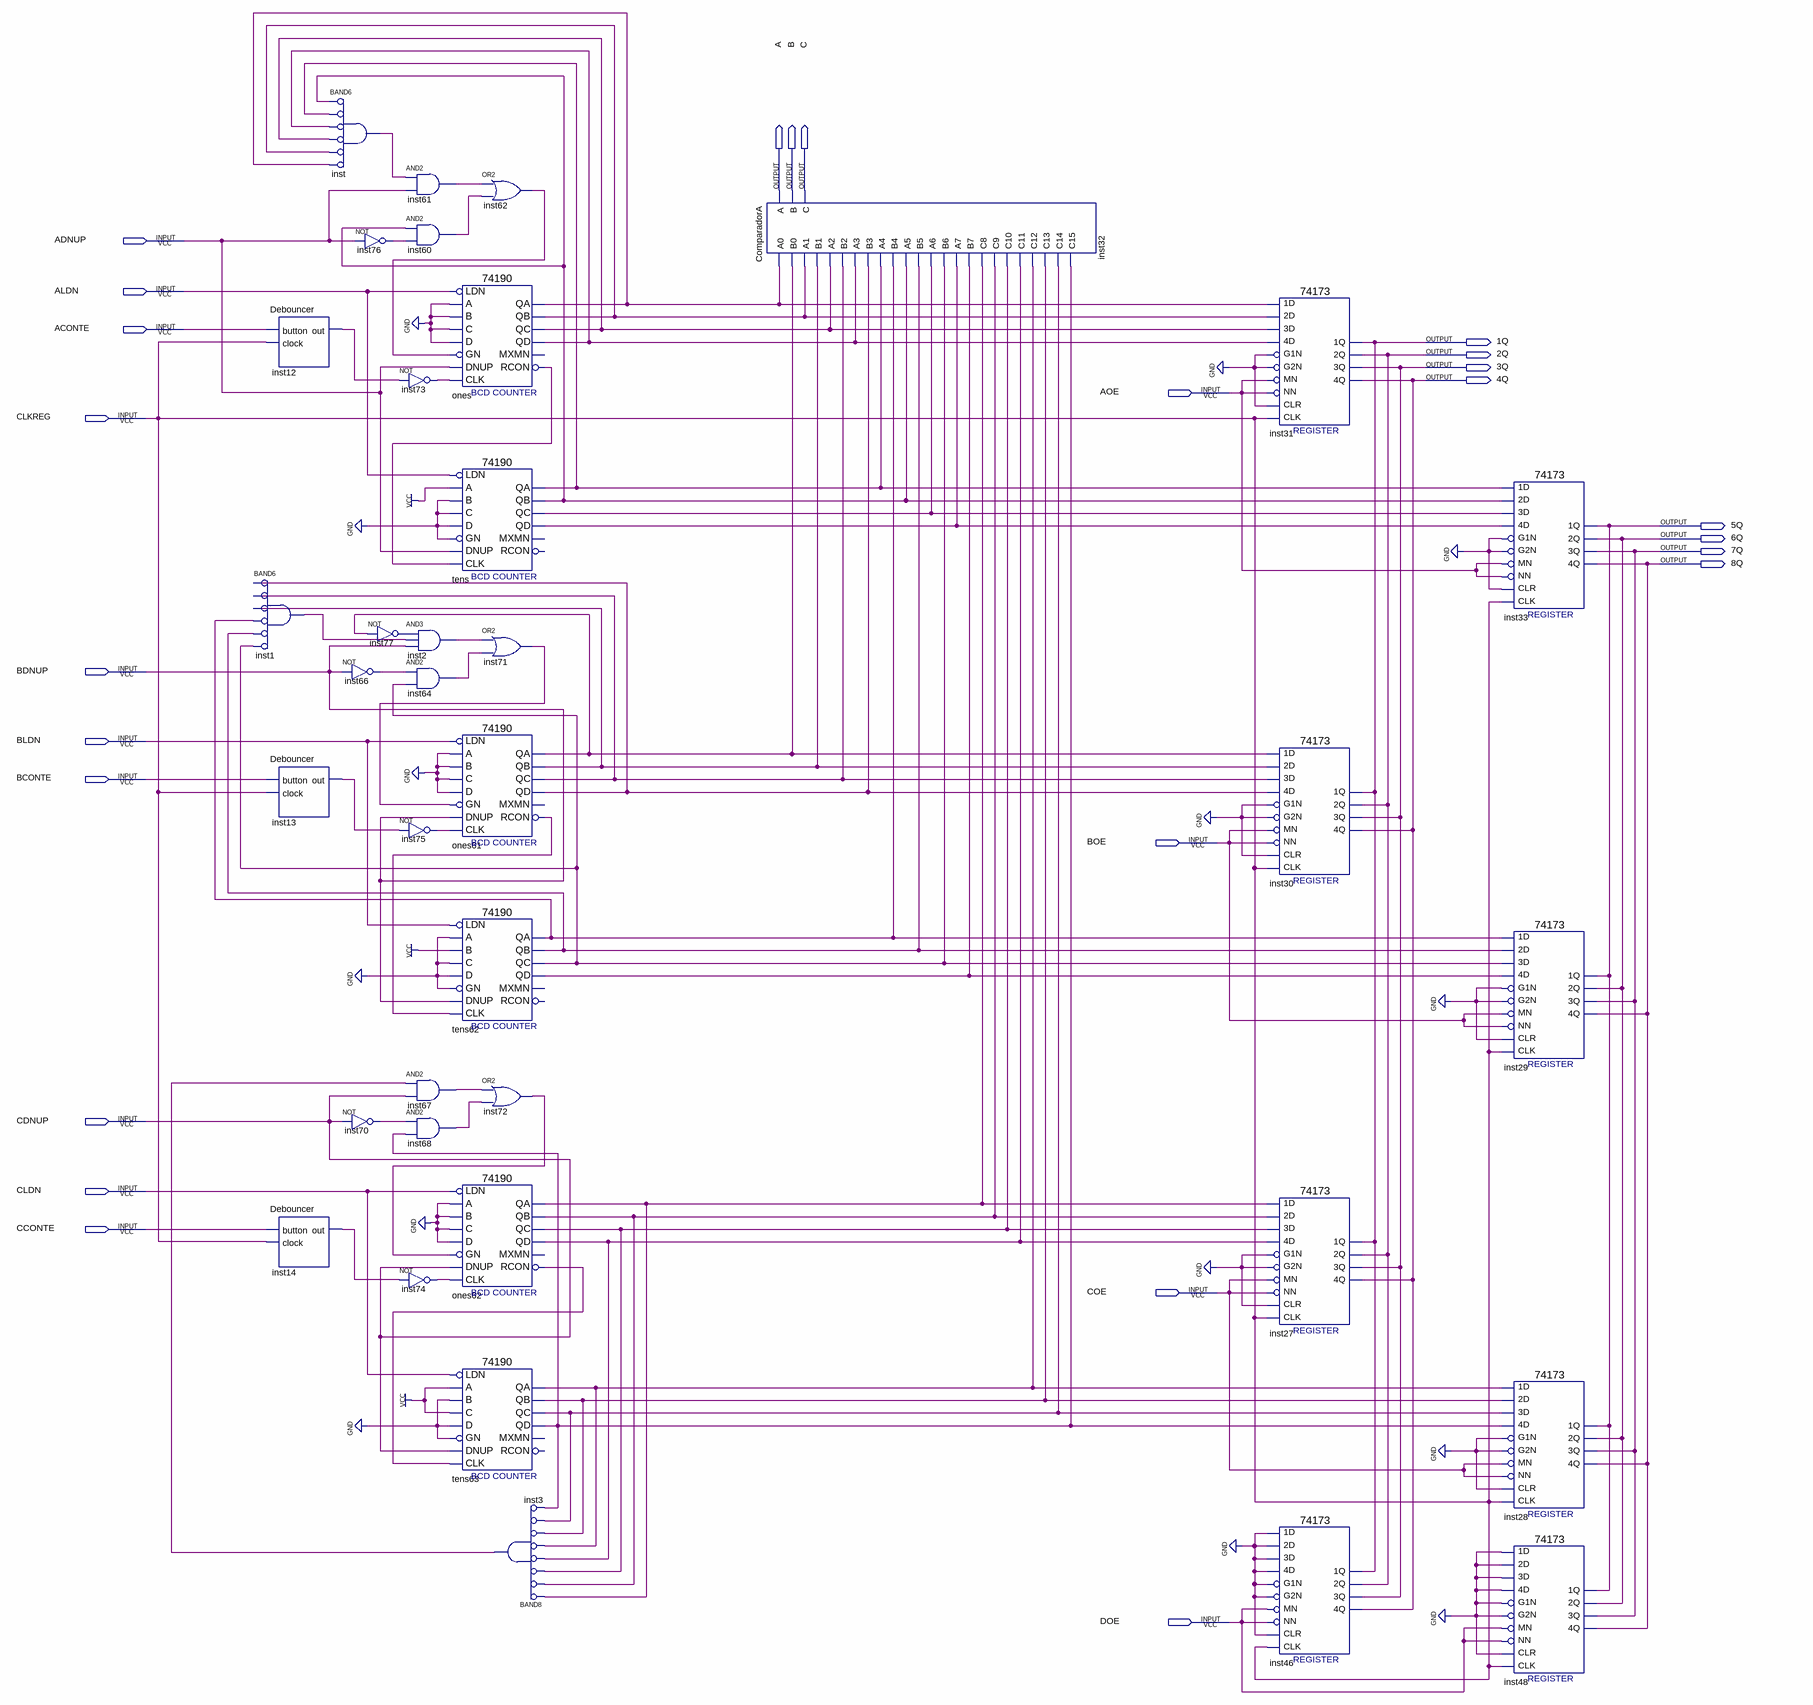
[diagram p0: schematic sheet]
// Quartus schematic Estacionamento.bdf as structural Verilog: 37 symbols, 25 pins
module Estacionamento (
  input  ADNUP,
  input  ALDN,
  input  ACONTE,
  input  AOE,
  input  CLKREG,
  input  BDNUP,
  input  BLDN,
  input  BCONTE,
  input  BOE,
  input  CDNUP,
  input  CLDN,
  input  CCONTE,
  input  COE,
  input  DOE,
  output A,
  output B,
  output C,
  output \1Q ,
  output \2Q ,
  output \3Q ,
  output \4Q ,
  output \5Q ,
  output \6Q ,
  output \7Q ,
  output \8Q 
);

  wire inst1_out, inst2_out, inst3_out, inst12_out, inst13_out, inst14_out, inst60_out, inst61_out,
       inst62_out, inst64_out, inst66_out, inst67_out, inst68_out, inst70_out, inst71_out, inst72_out,
       inst73_out, inst74_out, inst75_out, inst76_out, inst77_out, inst_out, ones61_qa, ones61_qb, ones61_qc,
       ones61_qd, ones61_rcon, ones62_qa, ones62_qb, ones62_qc, ones62_qd, ones62_rcon, ones_qa, ones_qb,
       ones_qc, ones_qd, ones_rcon, tens62_qa, tens62_qb, tens62_qc, tens62_qd, tens63_qa, tens63_qb,
       tens63_qc, tens63_qd, tens_qa, tens_qb, tens_qc, tens_qd;

  Debouncer inst12 (.button(ACONTE), .clock(CLKREG), .out(inst12_out));
  and inst1 (inst1_out, ~ones61_qd, ~ones61_qc, ~ones61_qb, ~tens62_qa, ~tens62_qb, ~tens62_qc);  // BAND6
  Debouncer inst13 (.button(BCONTE), .clock(CLKREG), .out(inst13_out));
  Debouncer inst14 (.button(CCONTE), .clock(CLKREG), .out(inst14_out));
  and inst (inst_out, ~tens_qb, ~tens_qa, ~ones_qd, ~ones_qc, ~ones_qb, ~ones_qa);  // BAND6
  not inst66 (inst66_out, BDNUP);
  not inst70 (inst70_out, CDNUP);
  not inst76 (inst76_out, ADNUP);
  not inst77 (inst77_out, ones61_qa);
  and inst61 (inst61_out, inst_out, ADNUP);
  and inst60 (inst60_out, tens_qb, inst76_out);
  not inst73 (inst73_out, inst12_out);
  and inst2 (inst2_out, inst77_out, inst1_out, BDNUP);
  and inst64 (inst64_out, inst66_out, tens62_qc);
  not inst75 (inst75_out, inst13_out);
  and inst67 (inst67_out, inst3_out, CDNUP);
  and inst68 (inst68_out, inst70_out, tens63_qd);
  not inst74 (inst74_out, inst14_out);
  or inst62 (inst62_out, inst61_out, inst60_out);
  \74190  ones (
    .LDN(ALDN), .A(1'b0), .C(1'b0), .B(1'b0), .D(1'b0), .GN(inst62_out), .CLK(inst73_out), .DNUP(ADNUP),
    .QA(ones_qa), .QB(ones_qb), .QD(ones_qd), .QC(ones_qc), .RCON(ones_rcon));  // open: MXMN
  \74190  tens (
    .LDN(ALDN), .A(1'b1), .C(1'b0), .B(1'b0), .D(1'b0), .GN(1'b0), .CLK(ones_rcon), .DNUP(ADNUP),
    .QA(tens_qa), .QB(tens_qb), .QD(tens_qd), .QC(tens_qc));  // open: MXMN, RCON
  or inst71 (inst71_out, inst2_out, inst64_out);
  \74190  ones61 (
    .LDN(BLDN), .A(1'b0), .C(1'b0), .B(1'b0), .D(1'b0), .GN(inst71_out), .CLK(inst75_out), .DNUP(BDNUP),
    .QA(ones61_qa), .QB(ones61_qb), .QD(ones61_qd), .QC(ones61_qc), .RCON(ones61_rcon));  // open: MXMN
  \74190  tens62 (
    .LDN(BLDN), .A(1'b0), .C(1'b0), .B(1'b1), .D(1'b0), .GN(1'b0), .CLK(ones61_rcon), .DNUP(BDNUP),
    .QA(tens62_qa), .QB(tens62_qb), .QD(tens62_qd), .QC(tens62_qc));  // open: MXMN, RCON
  or inst72 (inst72_out, inst67_out, inst68_out);
  \74190  ones62 (
    .LDN(CLDN), .A(1'b0), .C(1'b0), .B(1'b0), .D(1'b0), .GN(inst72_out), .CLK(inst74_out), .DNUP(CDNUP),
    .QA(ones62_qa), .QB(ones62_qb), .QD(ones62_qd), .QC(ones62_qc), .RCON(ones62_rcon));  // open: MXMN
  \74190  tens63 (
    .LDN(CLDN), .A(1'b1), .C(1'b1), .B(1'b0), .D(1'b0), .GN(1'b0), .CLK(ones62_rcon), .DNUP(CDNUP),
    .QA(tens63_qa), .QB(tens63_qb), .QD(tens63_qd), .QC(tens63_qc));  // open: MXMN, RCON
  and inst3 (inst3_out, ~ones62_qa, ~ones62_qb, ~ones62_qc, ~ones62_qd, ~tens63_qa, ~tens63_qb, ~tens63_qc, ~tens63_qd);  // BAND8
  ComparadorA inst32 (
    .A0(ones_qa), .B0(ones61_qa), .A1(ones_qb), .B1(ones61_qb), .A2(ones_qc), .B2(ones61_qc), .A3(ones_qd),
    .B3(ones61_qd), .A4(tens_qa), .B4(tens62_qa), .A5(tens_qb), .B5(tens62_qb), .A6(tens_qc), .B6(tens62_qc),
    .A7(tens_qd), .B7(tens62_qd), .C8(ones62_qa), .C9(ones62_qb), .C10(ones62_qc), .C11(ones62_qd),
    .C12(tens63_qa), .C13(tens63_qb), .C14(tens63_qc), .C15(tens63_qd), .A(A), .B(B), .C(C));
  \74173  inst31 (
    .\3D (ones_qc), .MN(AOE), .\1D (ones_qa), .\2D (ones_qb), .\4D (ones_qd), .G1N(1'b0), .G2N(1'b0),
    .NN(AOE), .CLR(1'b0), .CLK(CLKREG), .\3Q (\3Q ), .\2Q (\2Q ), .\1Q (\1Q ), .\4Q (\4Q ));
  \74173  inst30 (
    .\3D (ones61_qc), .MN(BOE), .\1D (ones61_qa), .\2D (ones61_qb), .\4D (ones61_qd), .G1N(1'b0), .G2N(1'b0),
    .NN(BOE), .CLR(1'b0), .CLK(CLKREG), .\3Q (\3Q ), .\2Q (\2Q ), .\1Q (\1Q ), .\4Q (\4Q ));
  \74173  inst27 (
    .\3D (ones62_qc), .MN(COE), .\1D (ones62_qa), .\2D (ones62_qb), .\4D (ones62_qd), .G1N(1'b0), .G2N(1'b0),
    .NN(COE), .CLR(1'b0), .CLK(CLKREG), .\3Q (\3Q ), .\2Q (\2Q ), .\1Q (\1Q ), .\4Q (\4Q ));
  \74173  inst46 (
    .\3D (1'b0), .MN(DOE), .\1D (1'b0), .\2D (1'b0), .\4D (1'b0), .G1N(1'b0), .G2N(1'b0), .NN(DOE),
    .CLR(1'b0), .CLK(CLKREG), .\3Q (\3Q ), .\2Q (\2Q ), .\1Q (\1Q ), .\4Q (\4Q ));
  \74173  inst33 (
    .\3D (tens_qc), .MN(AOE), .\1D (tens_qa), .\2D (tens_qb), .\4D (tens_qd), .G1N(1'b0), .G2N(1'b0),
    .NN(AOE), .CLR(1'b0), .CLK(CLKREG), .\3Q (\7Q ), .\2Q (\6Q ), .\1Q (\5Q ), .\4Q (\8Q ));
  \74173  inst29 (
    .\3D (tens62_qc), .MN(BOE), .\1D (tens62_qa), .\2D (tens62_qb), .\4D (tens62_qd), .G1N(1'b0), .G2N(1'b0),
    .NN(BOE), .CLR(1'b0), .CLK(CLKREG), .\3Q (\7Q ), .\2Q (\6Q ), .\1Q (\5Q ), .\4Q (\8Q ));
  \74173  inst28 (
    .\3D (tens63_qc), .MN(COE), .\1D (tens63_qa), .\2D (tens63_qb), .\4D (tens63_qd), .G1N(1'b0), .G2N(1'b0),
    .NN(COE), .CLR(1'b0), .CLK(CLKREG), .\3Q (\7Q ), .\2Q (\6Q ), .\1Q (\5Q ), .\4Q (\8Q ));
  \74173  inst48 (
    .\3D (1'b0), .MN(DOE), .\1D (1'b0), .\2D (1'b0), .\4D (1'b0), .G1N(1'b0), .G2N(1'b0), .NN(DOE),
    .CLR(1'b0), .CLK(CLKREG), .\3Q (\7Q ), .\2Q (\6Q ), .\1Q (\5Q ), .\4Q (\8Q ));
endmodule
